# Altium schematic sheet S00-OVERVIEW.SchDoc
size B; SheetNumber: 1; SheetTotal: 5; BLOCK-TITLE: OVERVIEW AND TITLE PAGE; BLOCK-SIZE: B; BLOCK-PROJECT: MULTIMOD AUDIO MODULE; BLOCK-REVISION: 1; BLOCK-ORGANIZATION: UNIVERSITY OF FLORIDA; BLOCK-DESIGNER: MEHRON TALEBI; BLOCK-IDENTIFIER: SUMMER 2023; BLOCK-REVIEWER: MIKE STAPLETON
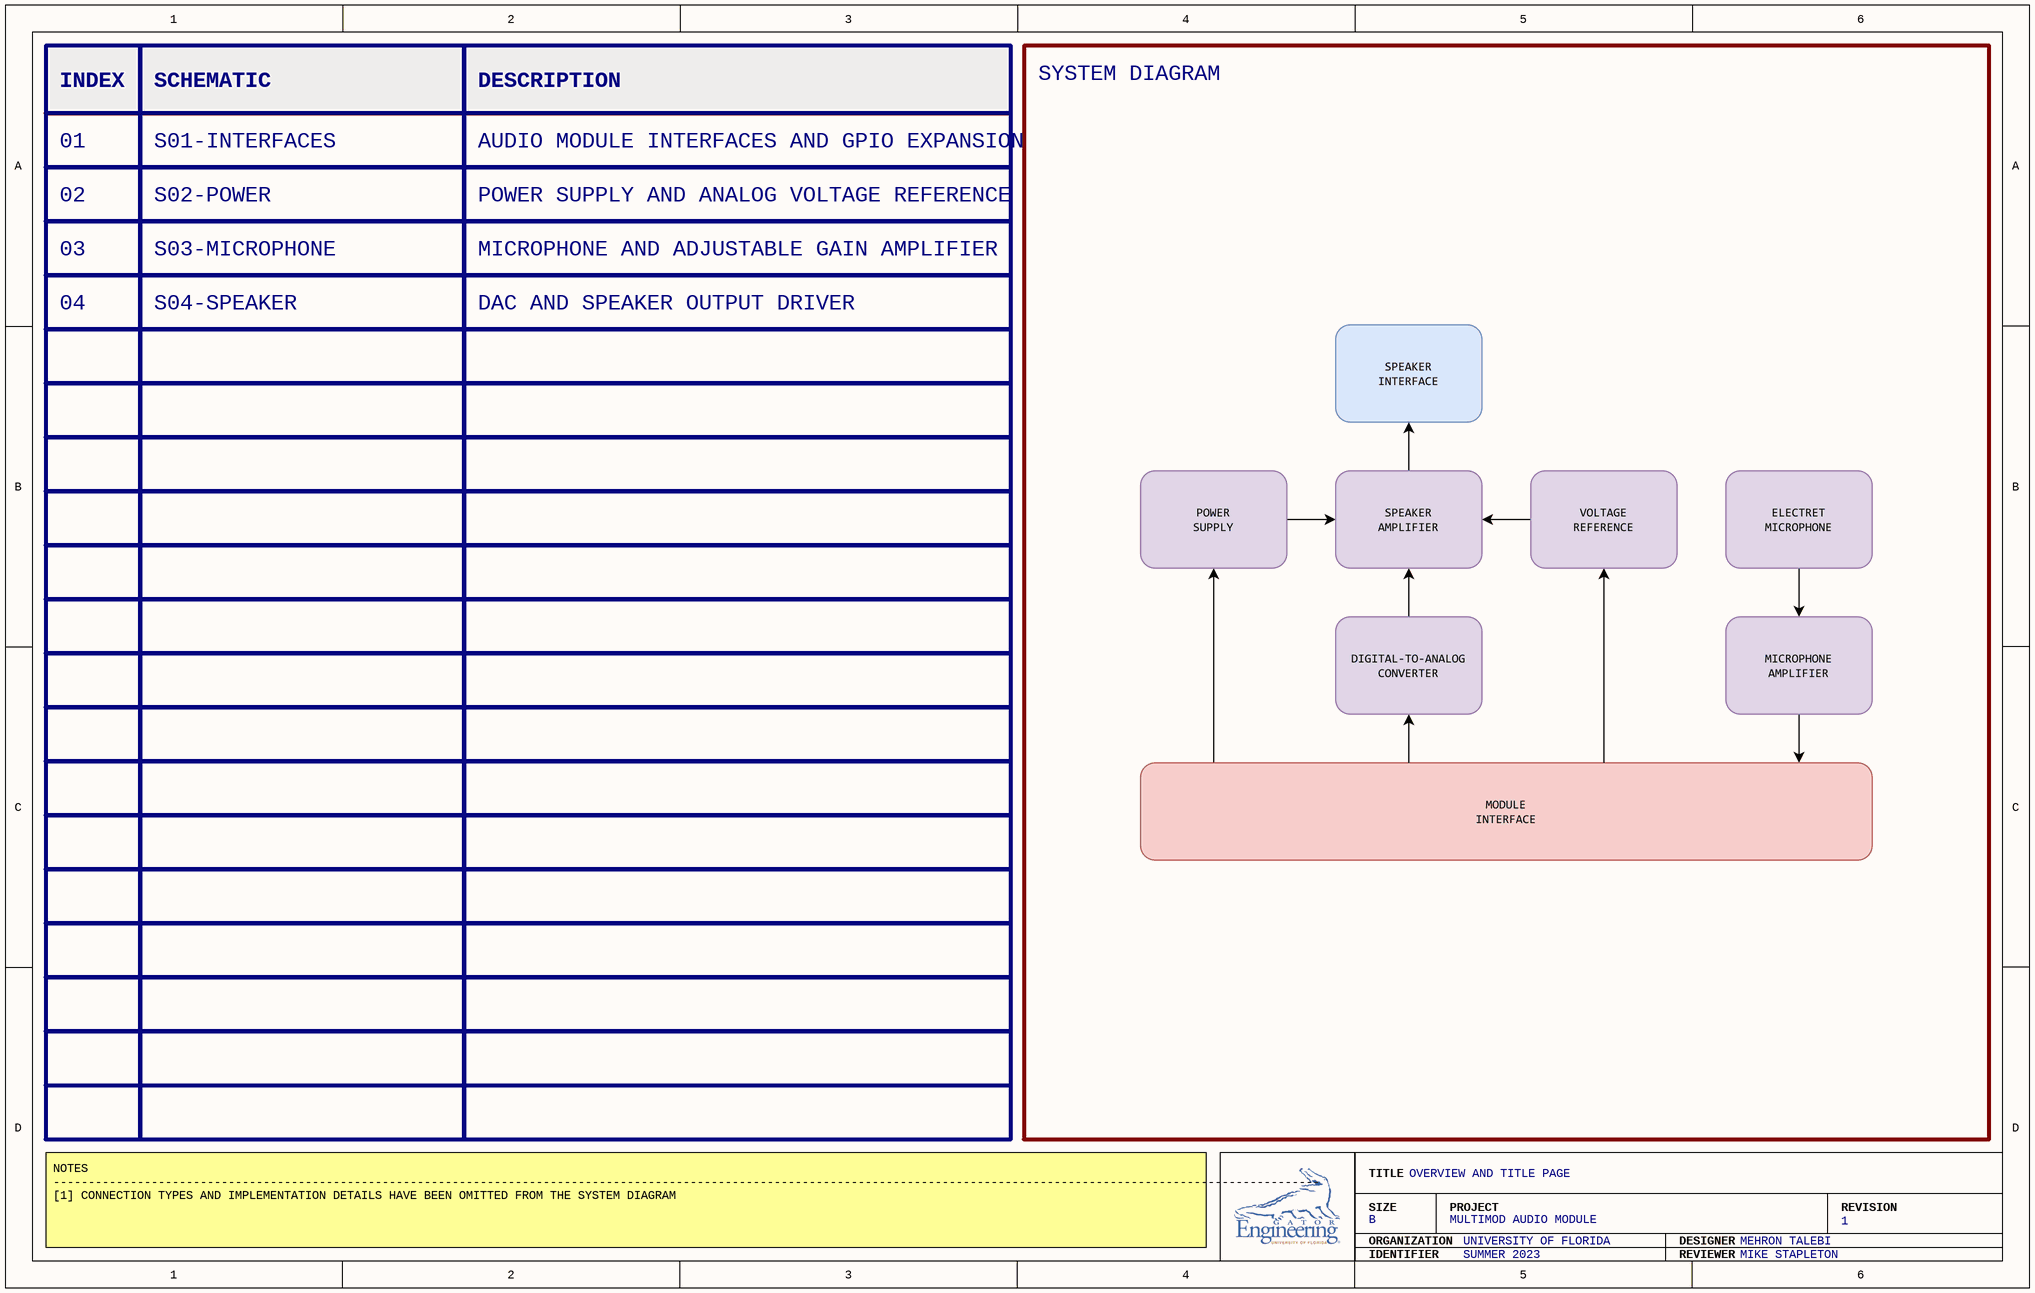
[diagram p0: S00-OVERVIEW.SchDoc]

## Notes on the sheet
- INDEX
- SCHEMATIC
- DESCRIPTION
- SYSTEM DIAGRAM
- 01
- S01-INTERFACES
- AUDIO MODULE INTERFACES AND GPIO EXPANSION
- 02
- 03
- S02-POWER
- S03-MICROPHONE
- POWER SUPPLY AND ANALOG VOLTAGE REFERENCE
- MICROPHONE AND ADJUSTABLE GAIN AMPLIFIER
- 04
- S04-SPEAKER
- DAC AND SPEAKER OUTPUT DRIVER
- NOTES
  -------------------------------------------------------------------------------------------------------------------------------------------------------------------------------------
  [1] CONNECTION TYPES AND IMPLEMENTATION DETAILS HAVE BEEN OMITTED FROM THE SYSTEM DIAGRAM
- TITLE
- SIZE
- ORGANIZATION
- PROJECT
- DESIGNER
- REVISION
- IDENTIFIER
- REVIEWER